# Altium schematic sheet MCU_PROG.SchDoc
size A3
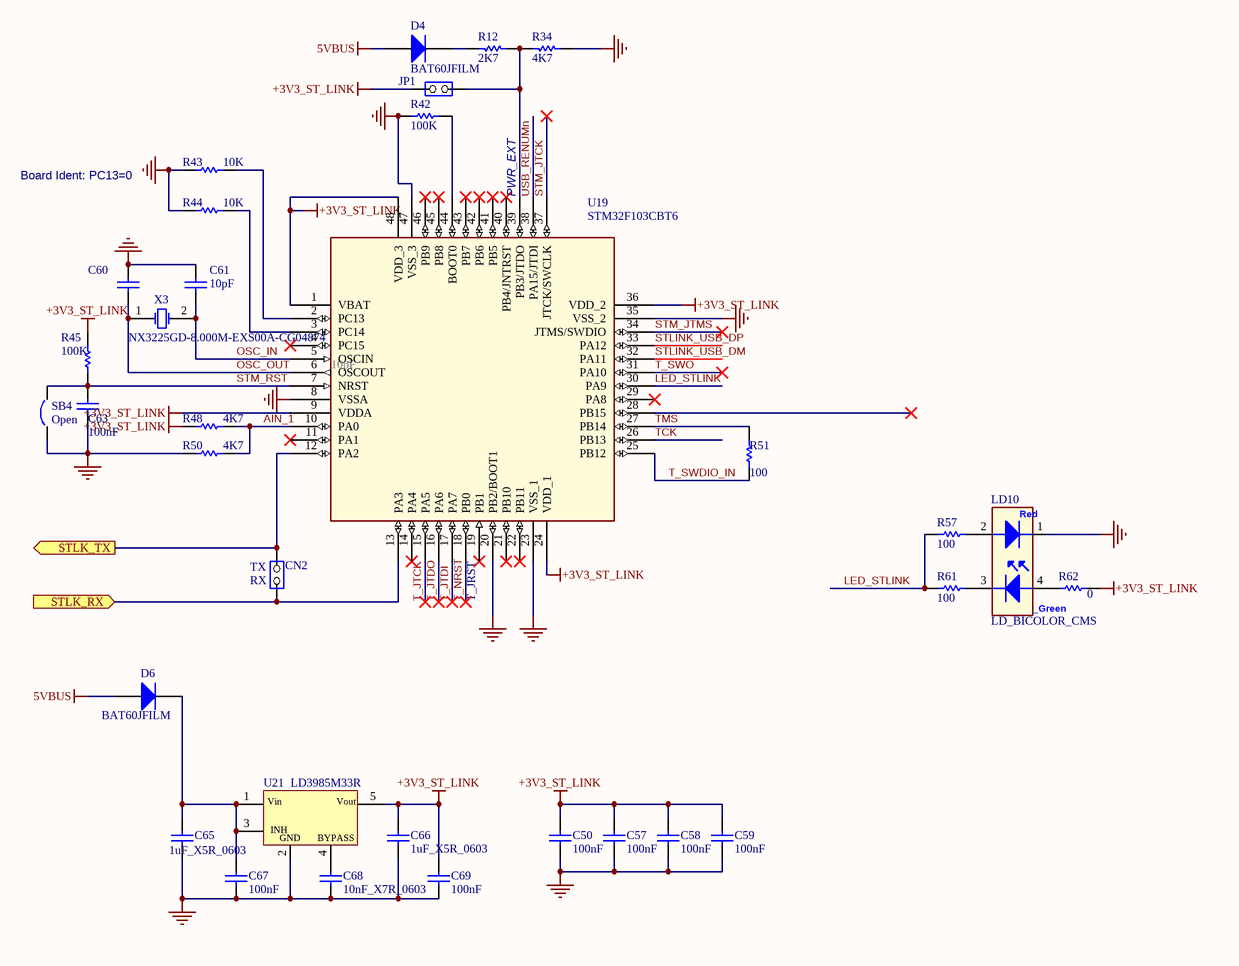
[diagram p0: MCU_PROG.SchDoc]

## Parts
C50  100nF  [CAPC1608X90]
C57  100nF  [CAPC1608X90]
C58  100nF  [CAPC1608X90]
C59  100nF  [CAPC1608X90]
C60  10pF  [CAPC1608X90]
C61  10pF  [CAPC1608X90]
C63  100nF  [CAPC1608X90]
C65  1uF_X5R_0603  [CAPC1608X90]
C66  1uF_X5R_0603  [CAPC1608X90]
C67  100nF  [CAPC1608X90]
C68  10nF_X7R_0603  [CAPC1608X90]
C69  100nF  [CAPC1608X90]
CN2  (no value)  [HDR_1x2_2R54_V_M_S]
D4  BAT60JFILM  [SOD-323]
D6  BAT60JFILM  [SOD-323]
JP1  (no value)  [HDR_1x2_2R54_V_M_S]
LD10  LD_BICOLOR_CMS  [LED_201-A00J1_BRA]
R12  2K7  [R0603]
R34  4K7  [RESC1607X60N]
R42  100K  [RESC1607X60N]
R43  10K  [RESC1608X55]
R44  10K  [RESC1607X60N]
R45  100K  [RESC1607X60N]
R48  4K7  [RESC1607X60N]
R50  4K7  [RESC1607X60N]
R51  100  [RESC1607X60N]
R57  100  [RESC1607X60N]
R61  100  [RESC1607X60N]
R62  0  [RESC1607X60N]
SB4  Open  [SB_0603]
U19  STM32F103CBT6  [QFP50P900X900X160-48N]
U21  LD3985M33R  [SOT95P280X145-5N]
X3  NX3225GD-8.000M-EXS00A-CG04874  [XTAL_NX3225GD_NDK-L]

## Ports
STLK_RX (in), STLK_TX (out)

## Nets
5VBUS: D4.1(A) D6.1(A)
+3V3_ST_LINK: C50.2 C57.2 C58.2 C59.2 C66.1 C69.2 JP1.1(COMMON) R45.2 R48.1 R62.2 U19.1(VBAT) U19.9(VDDA) U19.24(VDD_1) U19.36(VDD_2) U19.48(VDD_3) U21.5(Vout)
GND: C50.1 C57.1 C58.1 C59.1 C60.2 C61.2 C63.1 C65.1 C66.2 C67.1 C68.1 C69.1 LD10.1 R34.2 R42.1 R43.1 R44.1 R50.1 SB4.1 U19.8(VSSA) U19.20(PB2/BOOT1) U19.23(VSS_1) U19.35(VSS_2) U19.47(VSS_3) U21.2(GND)
AIN_1: R48.2 R50.2 U19.10(PA0)
LED_STLINK: R57.1 R61.1 U19.30(PA9)
OSC_IN: C61.1 U19.5(OSCIN) X3.2(OSC2)
OSC_OUT: C60.1 U19.6(OSCOUT) X3.1(OSC1)
STLINK_USB_DM: U19.32(PA11)
STLINK_USB_DP: U19.33(PA12)
STLK_RX: CN2.1(COMMON) U19.13(PA3) ; port STLK_RX
STLK_TX: CN2.2(NO) U19.12(PA2) ; port STLK_TX
STM_JTCK: U19.37(JTCK/SWCLK)
STM_JTMS: U19.34(JTMS/SWDIO)
STM_RST: C63.2 R45.1 SB4.2 U19.7(NRST)
T_JTCK: U19.15(PA5)
T_JTDI: U19.17(PA7)
T_JTDO: U19.16(PA6)
T_NRST: U19.18(PB0)
T_SWDIO_IN: R51.1 U19.25(PB12)
T_SWO: U19.31(PA10)
TCK: U19.26(PB13)
TMS: R51.2 U19.27(PB14)
USB_RENUMn: U19.38(PA15/JTDI)
NetC65_2: C65.2 C67.2 D6.2(K) U21.1(Vin) U21.3(CE)
NetC68_2: C68.2 U21.4(BYPASS)
NetD4_2: D4.2(K) R12.1
NetJP1_2: JP1.2(NO) R12.2 R34.1 U19.39(PB3/JTDO)
NetLD10_2: LD10.2 R57.2
NetLD10_3: LD10.3 R61.2
NetLD10_4: LD10.4 R62.1
NetR42_2: R42.2 U19.44(BOOT0)
NetR43_2: R43.2 U19.2(PC13)
NetR44_2: R44.2 U19.3(PC14)

Not connected (* = marked no-connect by the designer): U19 4(PC15)* 11(PA1)* 14(PA4)* 19(PB1)* 21(PB10)* 22(PB11)* 28(PB15)* 29(PA8)* 40(PB4/JNTRST)* 41(PB5)* 42(PB6)* 43(PB7)* 45(PB8)* 46(PB9)*

## Notes on the sheet
- Board Ident: PC13=0
- (near U19) PWR_EXT
- (near CN2) TX
- (near CN2) RX
- (near U19) T_JRST
- (in symbol LD3985M33R) INH
- (in symbol LD_BICOLOR_CMS) Red; _Green

## Library data of the parts
C50 C57-C59 C63 C67 C69 = Capacitor_ST: Capacitor 0402 / 0603 / 0805; Revision: July-2002: Re-released for DXP Platform.; Value: 100nF
C60 C61 = Capacitor_ST: Capacitor 0402 / 0603 / 0805; Value: 100nF; Revision: July-2002: Re-released for DXP Platform.
C65 C66 = CAP SMD 0603  X5R 1µF 25V 10%: 0603  X5R 1µF; Rated voltage: 25V; Tolerance: 10%; Manufacturer: *; Manufacturer P/N: *; Order code Farnell: 1288202RL; Value: 1µF; Power: *; Technology: X5R; Temperature  Factor: *; Temperature Max: +125°C; Temperature Min: -55°C; STS Code: *
C68 = CAP SMD 0603  X7R 10000PF 50V 10%: 0603  X7R 10NF; Order code RS: 2040779; Rated voltage: 50V; Tolerance: 10%; Order code Farnell: 7569548RL; Value: 10NF; Power: *; Technology: X7R; Temperature Factor: *; Temperature Min: -55°C; Temperature Max: +125°C; STS Code: *
CN2 = JP2: Fitted: NO
D4 = Diode: Default Diode; Code - JEDEC: DO-214-AB; Ordered by: STM; ECCN_US/EU: EAR99/NEC; Published: 8-Jun-2000; Revision: July-2002: Re-released for DXP Platform.; Publisher: Altium Limited
D6 = BAT60JFILM: Manuf_1: STM; Provided: ST; ECCN_US/EU: EAR99/NEC; Revision: July-2002: Re-released for DXP Platform.; Order: BAT60JFILM; Manuf_Part_1: BAT60JFILM; Distrib: ST
JP1 = JP2
LD10 = LD_BICOLOR_CMS: Bicolor Led; Manuf_Part_1: HSMF-A201-A00J1; Manuf_1: Avago Technologies; Ref St: xxxxxx; cap_dec: ----; Distrib: RADIOSPARES; Footprint: HSMF-A201
R12 R34 = Res1: Resistor; Value: 1K; Published: 8-Jun-2000; Revision: July-2002: Re-released for DXP Platform.; Publisher: Altium Limited
R42 R45 R51 R57 R61 R62 = Resistor_ST: Resistor 0402 / 0603 / 0805; Value: 10K
R43 = Resistor_ST: Resistor 0402 / 0603 / 0805; Value: 10K
R44 = Resistor_ST: Resistor 0402 / 0603 / 0805; Fitted: NO; Value: 10K
R48 R50 = Resistor_ST: Resistor 0402 / 0603 / 0805; Value: 10K; Fitted: NO
SB4 = Circuit Breaker: Published: 24-Mar-1999; Revision: July-2002: Re-released for DXP Platform.; Publisher: Altium Limited
U19 = STM32F103CBT6: Medium-density performance line ARM-based 32-bit MCU with 64KB Flash; Manuf_Part_1: STM32F103C8T6; Manuf_1: STM; Ref St: 9175981; Provided: ST; ECCN_US/EU: 3A991A2/NEC; Footprint: QFP48 7X7; Distrib: ST; Order: STM32F103C8T6
U21 = LD3985M33R: Ultra low drop-low noise BiCMOS voltage, regulators low ESR capacitors compatible; Manuf_1: STM; Provided: ST; Ref St: 9176161; ECCN_US/EU: EAR99/NEC; Manuf_Part_1: LD3985M33R; Distrib: ST; Order: LD3985M33R
X3 = XTAL: Crystal Oscillator; Published: 8-Jun-2000; LatestRevisionDate: 17-Jul-2002; LatestRevisionNote: Re-released for DXP Platform.; PackageReference: R38; Publisher: Altium Limited